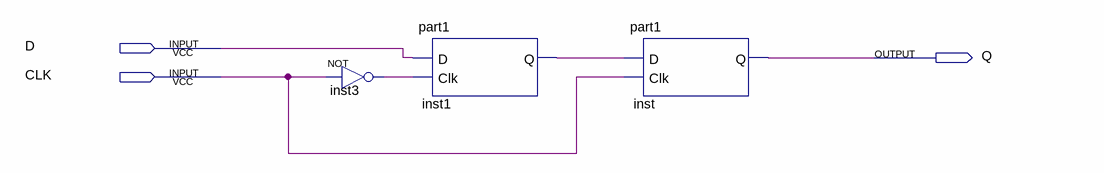
[diagram p0: schematic sheet]
// Quartus schematic part3.bdf as structural Verilog: 3 symbols, 3 pins
module part3 (
  input  D,
  input  CLK,
  output Q
);

  wire inst1_q, inst3_out;

  not inst3 (inst3_out, CLK);
  part1 inst1 (.D(D), .Clk(inst3_out), .Q(inst1_q));
  part1 inst (.D(inst1_q), .Clk(CLK), .Q(Q));
endmodule
